# Altium schematic sheet Sh_Alims.SchDoc
size A4
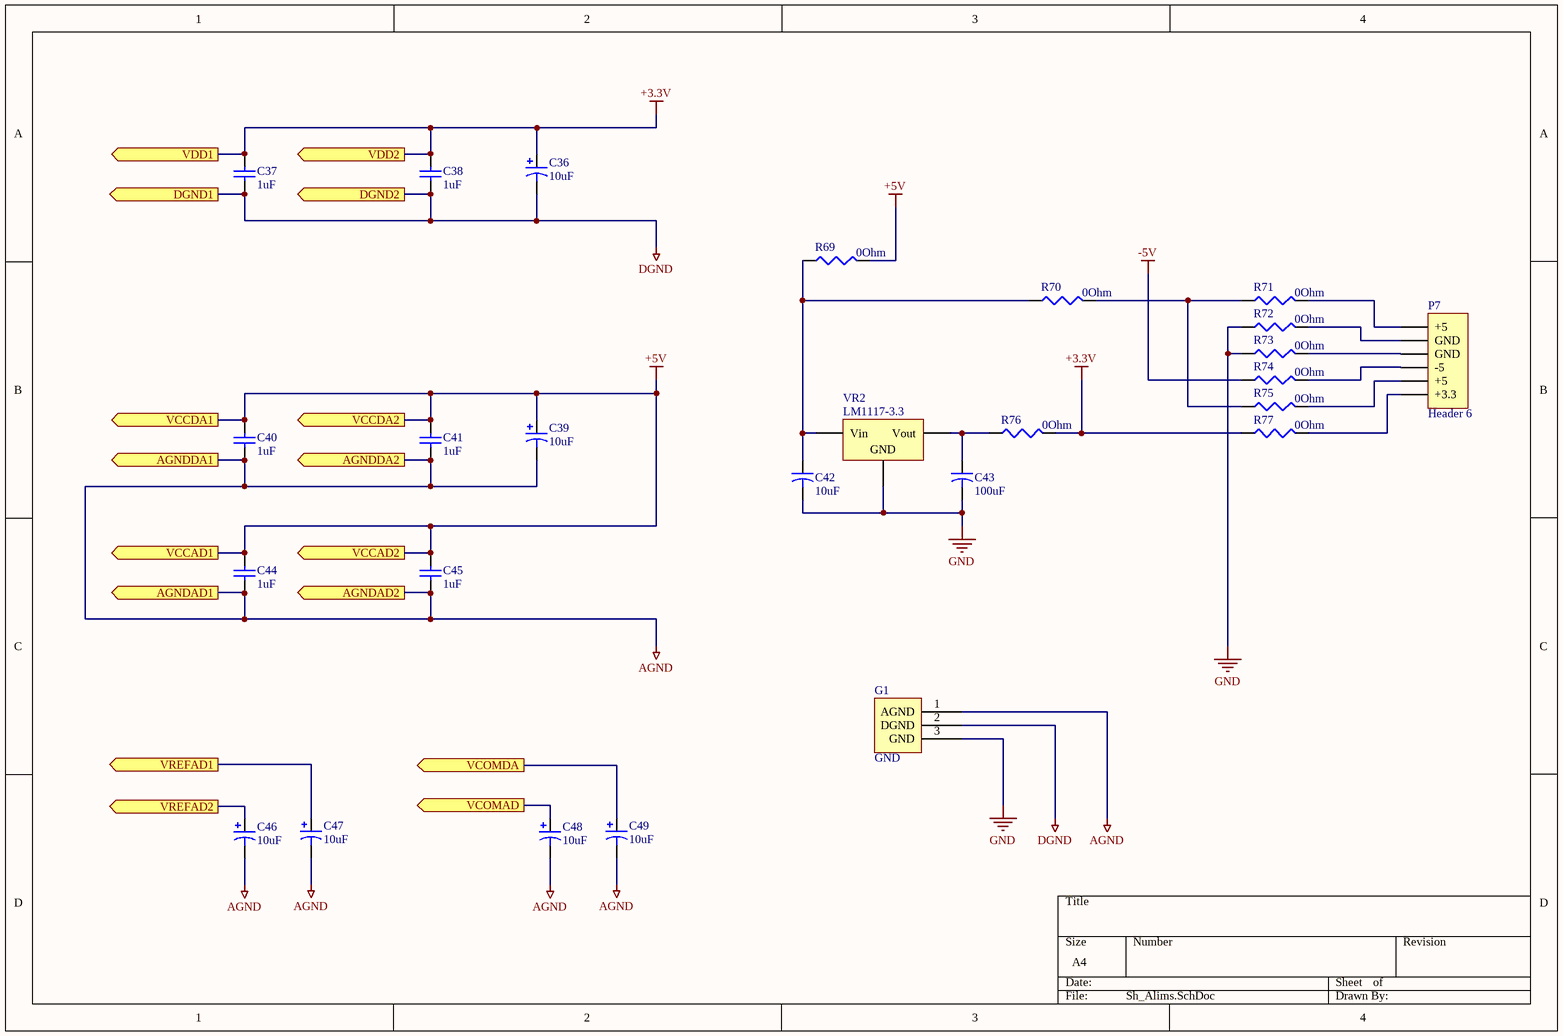
[diagram p0: Sh_Alims.SchDoc]

## Parts
C36  value 10uF  [Cd_elec]  (hidden comment: Cap Pol3)
C37  value 1uF  [1608[0603]]  (hidden comment: Cap Semi)
C38  value 1uF  [1608[0603]]  (hidden comment: Cap Semi)
C39  value 10uF  [Cd_elec]  (hidden comment: Cap Pol3)
C40  value 1uF  [1608[0603]]  (hidden comment: Cap Semi)
C41  value 1uF  [1608[0603]]  (hidden comment: Cap Semi)
C42  10uF  [CAPR5-4X5]
C43  100uF  [CAPR5-4X5]
C44  value 1uF  [1608[0603]]  (hidden comment: Cap Semi)
C45  value 1uF  [1608[0603]]  (hidden comment: Cap Semi)
C46  value 10uF  [Cd_elec]  (hidden comment: Cap Pol3)
C47  value 10uF  [Cd_elec]  (hidden comment: Cap Pol3)
C48  value 10uF  [Cd_elec]  (hidden comment: Cap Pol3)
C49  value 10uF  [Cd_elec]  (hidden comment: Cap Pol3)
G1  GND  [GND]
P7  Header 6  [HDR1X6]
R69  value 0Ohm  [J1-0603]  (hidden comment: Res3)
R70  value 0Ohm  [J1-0603]  (hidden comment: Res3)
R71  value 0Ohm  [J1-0603]  (hidden comment: Res3)
R72  value 0Ohm  [J1-0603]  (hidden comment: Res3)
R73  value 0Ohm  [J1-0603]  (hidden comment: Res3)
R74  value 0Ohm  [J1-0603]  (hidden comment: Res3)
R75  value 0Ohm  [J1-0603]  (hidden comment: Res3)
R76  value 0Ohm  [J1-0603]  (hidden comment: Res3)
R77  value 0Ohm  [J1-0603]  (hidden comment: Res3)
VR2  LM1117-3.3  [D2PAK_N]

## Ports
AGNDAD1 (out), AGNDAD2 (out), AGNDDA1 (out), AGNDDA2 (out), DGND1 (out), DGND2 (out), VCCAD1 (out), VCCAD2 (out), VCCDA1 (out), VCCDA2 (out), VCOMAD (out), VCOMDA (out), VDD1 (out), VDD2 (out), VREFAD1 (out), VREFAD2 (out)

## Nets
+3.3V: C36.1 C37.2 C38.2 R76.2 R77.1 ; port VDD1, port VDD2
+5V: C39.1 C40.2 C41.2 C44.2 C45.2 R69.2 ; port VCCDA1, port VCCDA2, port VCCAD2, port VCCAD1
-5V: R74.1
AGND: C39.2 C40.1 C41.1 C44.1 C45.1 C46.2 C47.2 C48.2 C49.2 G1.1(AGND) ; port AGNDAD1, port AGNDAD2, port AGNDDA1, port AGNDDA2
DGND: C36.2 C37.1 C38.1 G1.2(DGND) ; port DGND1, port DGND2
GND: C42.2 C43.2 G1.3(GND) R72.1 R73.1 VR2.2(GND)
VCOMAD: C48.1 ; port VCOMAD
VCOMDA: C49.1 ; port VCOMDA
VREFAD1: C47.1 ; port VREFAD1
VREFAD2: C46.1 ; port VREFAD2
NetC42_1: C42.1 R69.1 R70.1 VR2.1(Vin)
NetC43_1: C43.1 R76.1 VR2.3(Vout)
NetP7_1: P7.1(+5) R71.2
NetP7_2: P7.2(GND) R72.2
NetP7_3: P7.3(GND) R73.2
NetP7_4: P7.4(-5) R74.2
NetP7_5: P7.5(+5) R75.2
NetP7_6: P7.6(+3.3) R77.2
NetR70_2: R70.2 R71.1 R75.1

## Library data of the parts
C36 C39 C46-C49 = Cap Pol3: Polarized Capacitor (Surface Mount); Published: 8-Jun-2000; LatestRevisionDate: 29-May-2009; LatestRevisionNote: IPC-7351 Footprint Added.; PackageReference: C0805; Publisher: Altium Limited; PackageDescription: Chip Capacitor
C37 C38 C40 C41 C44 C45 = Cap Semi: Capacitor (Semiconductor SIM Model); Published: 8-Jun-2000; LatestRevisionDate: 29-May-2009; LatestRevisionNote: IPC-7351 Footprint Added.; PackageReference: C1206; Publisher: Altium Limited; PackageDescription: Chip Capacitor
C42 = Cap2: Capacitor; Value: 10u; Published: 23-Sep-2002; PackageReference: CAPR5-4X5; Publisher: Altium Limited; PackageDescription: Capacitor; 2 Leads
C43 = Cap2: Capacitor; Value: 100u; Published: 23-Sep-2002; PackageReference: CAPR5-4X5; Publisher: Altium Limited; PackageDescription: Capacitor; 2 Leads
P7 = Header 6: Header, 6-Pin; LatestRevisionDate: 17-Jul-2002; LatestRevisionNote: Re-released for DXP Platform.; Publisher: Altium Limited
R69-R77 = Res3: Resistor; Published: 8-Jun-2000; LatestRevisionDate: 29-May-2009; LatestRevisionNote: IPC-7351 Footprint Added.; PackageReference: J1-0603; Publisher: Altium Limited; PackageDescription: Chip Resistor
VR2 = Volt Reg: Voltage Regulator; Published: 24-Mar-1999; LatestRevisionDate: 29-May-2009; LatestRevisionNote: IPC-7351 Footprint Added.; PackageReference: D2PAK; Publisher: Altium Limited; PackageDescription: 3-Pin Transistor Outline Package 2.54 mm Pitch, 15.1 mm Lead Span